# EAGLE design LMNC VCO - v1.2 (EAGLE 9.5.2)

## Sheet 1 of 2
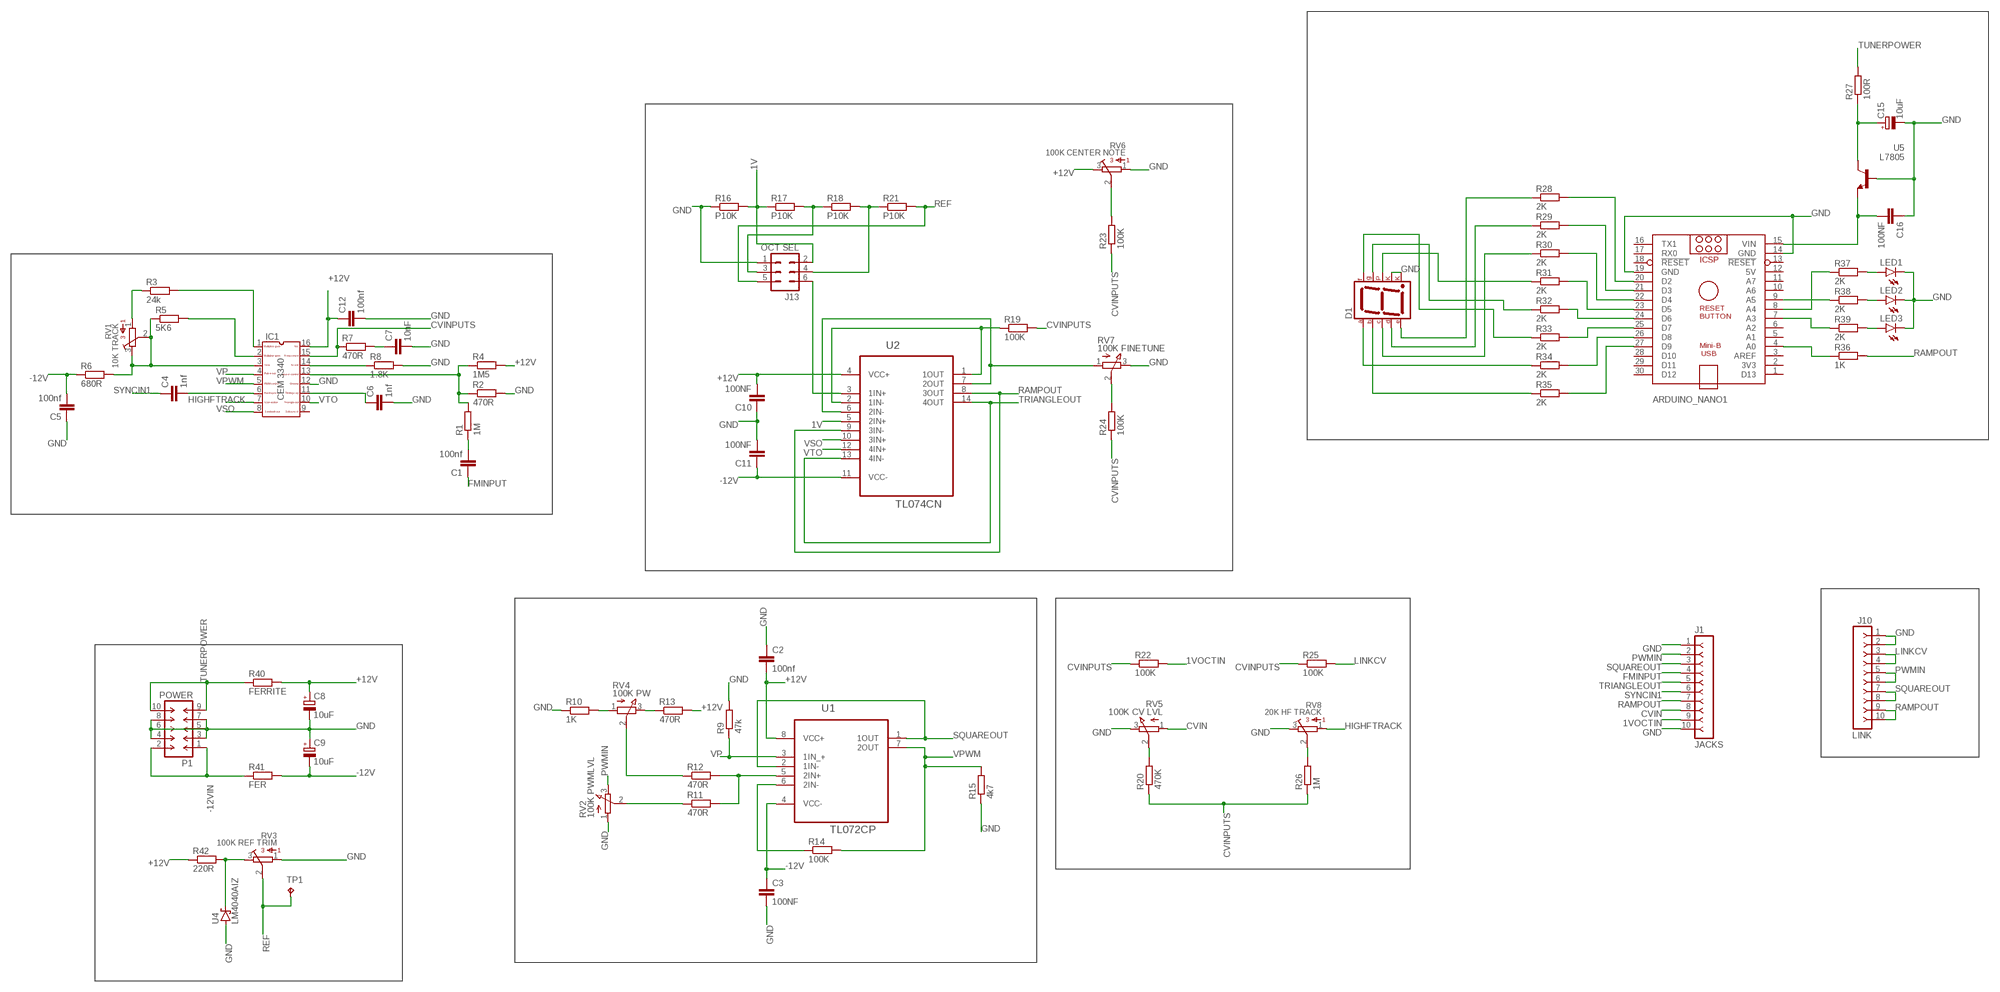
[diagram p0: schematic, sheet 1]

### Parts
ARDUINO_NANO1  ARDUINO_NANO  [ARDUINO_NANO]
C1  100nf  C2,5-3  [C2.5-3]
C2  100nf  C2,5-3  [C2.5-3]
C3  100NF  C2,5-3  [C2.5-3]
C4  1nf  C2,5-3  [C2.5-3]
C5  100nf  C2,5-3  [C2.5-3]
C6  1nf  C2,5-3  [C2.5-3]
C7  10nF  C2,5-3  [C2.5-3]
C8  10uF  CPOL-EUE2.5-5  [E2,5-5]
C9  10uF  CPOL-EUE2.5-5  [E2,5-5]
C10  100NF  C2,5-3  [C2.5-3]
C11  100NF  C2,5-3  [C2.5-3]
C12  100nf  C2,5-3  [C2.5-3]
C15  10uF  CPOL-EUE2.5-5  [E2,5-5]
C16  100NF  C2,5-3  [C2.5-3]
D1  7SEG-CK  [7SEG-13]
IC1  CEM3340  [DIL16]
J1  JACKS  F-1X10-SIP-100-32Y  [SIP-100-10-32Y]
J10  LINK  F-1X10-SIP-100-32Y  [SIP-100-10-32Y]
J13  OCT SEL  MA03-2  [MA03-2]
LED1  LED3MM  [LED3MM]
LED2  LED3MM  [LED3MM]
LED3  LED3MM  [LED3MM]
P1  POWER  M-2X05-DIL-100  [DIL-100-2X05]
R1  1M  R-EU_0207/10  [0207/10]
R2  470R  R-EU_0207/10  [0207/10]
R3  24k  R-EU_0207/10  [0207/10]
R4  1M5  R-EU_0207/10  [0207/10]
R5  5K6  R-EU_0207/10  [0207/10]
R6  680R  R-EU_0207/10  [0207/10]
R7  470R  R-EU_0207/10  [0207/10]
R8  1.8K  R-EU_0207/10  [0207/10]
R9  47k  R-EU_0207/10  [0207/10]
R10  1K  R-EU_0207/10  [0207/10]
R11  470R  R-EU_0207/10  [0207/10]
R12  470R  R-EU_0207/10  [0207/10]
R13  470R  R-EU_0207/10  [0207/10]
R14  100K  R-EU_0207/10  [0207/10]
R15  4k7  R-EU_0207/10  [0207/10]
R16  P10K  R-EU_0207/10  [0207/10]
R17  P10K  R-EU_0207/10  [0207/10]
R18  P10K  R-EU_0207/10  [0207/10]
R19  100K  R-EU_0207/10  [0207/10]
R20  470K  R-EU_0207/10  [0207/10]
R21  P10K  R-EU_0207/10  [0207/10]
R22  100K  R-EU_0207/10  [0207/10]
R23  100K  R-EU_0207/10  [0207/10]
R24  100K  R-EU_0207/10  [0207/10]
R25  100K  R-EU_0207/10  [0207/10]
R26  1M  R-EU_0207/10  [0207/10]
R27  100R  R-EU_0207/10  [0207/10]
R28  2K  R-EU_0207/10  [0207/10]
R29  2K  R-EU_0207/10  [0207/10]
R30  2K  R-EU_0207/10  [0207/10]
R31  2K  R-EU_0207/10  [0207/10]
R32  2K  R-EU_0207/10  [0207/10]
R33  2K  R-EU_0207/10  [0207/10]
R34  2K  R-EU_0207/10  [0207/10]
R35  2K  R-EU_0207/10  [0207/10]
R36  1K  R-EU_0207/10  [0207/10]
R37  2K  R-EU_0207/10  [0207/10]
R38  2K  R-EU_0207/10  [0207/10]
R39  2K  R-EU_0207/10  [0207/10]
R40  FERRITE  R-EU_0207/10  [0207/10]
R41  FER  R-EU_0207/10  [0207/10]
R42  220R  R-EU_0207/10  [0207/10]
RV1  10K TRACK  3386-W  [3386W]
RV2  100K PWMLVL  EVUF2A  [EVUF]
RV3  100K REF TRIM  3386-W  [3386W]
RV4  100K PW  EVUF2A  [EVUF]
RV5  100K CV LVL  EVUF2A  [EVUF]
RV6  100K CENTER NOTE  3386-W  [3386W]
RV7  100K FINETUNE  EVUF2A  [EVUF]
RV8  20K HF TRACK  3386-W  [3386W]
TP1  4v  TPB2,54  [B2,54]
U1  TL072CP  [DIP254P762X508-8]
U2  TL074CN  [DIP254P762X508-14]
U4  LM4040AIZ  SCHOTTKY-DIODE  [SOT54A]
U5  L7805  2SC1306  [TO220BV]

### Nets
1V: J13.2 R16.2 R17.1 U2.5(2IN+)
1VOCTIN: J1.9 R22.2
+12V: C2.2 C8.+ C10.2 C12.1 IC1.16 R4.2 R13.2 R40.2 R42.1 RV6.3 U1.8(VCC+) U2.4(VCC+)
-12V: C3.1 C5.2 C9.- C11.1 R6.1 R41.2 U1.4(VCC-) U2.11(VCC-)
-12VIN: P1.1 P1.2 R41.1
CVIN: J1.8 RV5.1(A)
CVINPUTS: IC1.15 R7.1 R19.2 R20.1 R22.1 R23.1 R24.1 R25.1 R26.1
FMINPUT: C1.1 J1.4
GND: ARDUINO_NANO1.14(GND) ARDUINO_NANO1.19(GND) C2.1 C3.2 C5.1 C6.2 C7.2 C8.- C9.+ C10.1 C11.2 C12.2 C15.- C16.1 D1.3(CK1) D1.8(CK2) IC1.12 J1.1 J1.10 J10.1 J10.2 J13.1 LED1.K(C) LED2.K(C) LED3.K(C) P1.3 P1.4 P1.5 P1.6 P1.7 P1.8 R2.2 R8.2 R9.2 R10.1 R15.1 R16.1 RV2.1(A) RV3.1 RV5.3(E) RV6.1 RV7.3(E) RV8.3 U4.A1(A) U5.1(B)
HIGHFTRACK: IC1.7 RV8.1
LINKCV: J10.3 J10.4 R25.2
N$1: IC1.2 R5.2
N$2: IC1.1 R3.2
N$3: IC1.3 R5.1 R6.2 RV1.2 RV1.3
N$4: R3.1 RV1.1
N$5: C7.1 R7.2
N$6: C1.2 R1.1
N$7: C4.2 IC1.6
N$8: C6.1 IC1.11
N$9: R14.1 U1.6(2IN-)
N$10: R11.2 R12.2 U1.5(2IN+)
N$11: IC1.14 R8.1
N$12: IC1.13 R1.2 R2.1 R4.1
N$13: R12.1 RV4.2(S)
N$14: R11.1 RV2.2(S)
N$15: R10.2 RV4.1(A)
N$16: R13.1 RV4.3(E)
N$17: RV7.1(A) U2.6(2IN-) U2.7(2OUT)
N$18: J13.6 U2.3(1IN+)
N$19: C15.+ R27.1 U5.2(C)
N$20: J13.3 R17.2 R18.1
N$21: J13.4 R18.2 R21.1
N$22: R24.2 RV7.2(S)
N$23: R19.1 U2.1(1OUT) U2.2(1IN-)
N$24: R23.2 RV6.2
N$25: ARDUINO_NANO1.24(D6) R32.2
N$29: R20.2 RV5.2(S)
N$30: R26.2 RV8.2
N$31: R42.2 RV3.3 U4.A2(C)
N$32: ARDUINO_NANO1.25(D7) R33.2
N$33: ARDUINO_NANO1.26(D8) R34.2
N$34: ARDUINO_NANO1.27(D9) R35.2
N$35: ARDUINO_NANO1.23(D5) R31.2
N$36: ARDUINO_NANO1.22(D4) R30.2
N$37: ARDUINO_NANO1.21(D3) R29.2
N$38: ARDUINO_NANO1.20(D2) R28.2
N$39: ARDUINO_NANO1.9(A5) R38.1
N$40: ARDUINO_NANO1.7(A3) R39.1
N$41: ARDUINO_NANO1.8(A4) R37.1
N$42: LED1.A R37.2
N$43: LED2.A R38.2
N$44: LED3.A R39.2
N$45: ARDUINO_NANO1.4(A0) R36.1
N$46: ARDUINO_NANO1.15(VIN) C16.2 U5.3(E)
N$47: D1.6(B) R35.1
N$48: D1.7(A) R34.1
N$49: D1.4(C) R30.1
N$50: D1.2(D) R29.1
N$51: D1.1(E) R28.1
N$52: D1.9(F) R33.1
N$53: D1.10(G) R32.1
N$54: D1.5(DP) R31.1
PWMIN: J1.2 J10.5 J10.6 RV2.3(E)
RAMPOUT: J1.7 J10.9 J10.10 R36.2 U2.8(3OUT) U2.9(3IN-)
REF: J13.5 R21.2 RV3.2 TP1.TP
SQUAREOUT: J1.3 J10.7 J10.8 U1.1(1OUT) U1.2(1IN-)
SYNCIN1: C4.1 J1.6
TRIANGLEOUT: J1.5 U2.13(4IN-) U2.14(4OUT)
TUNERPOWER: P1.9 P1.10 R27.2 R40.1
VP: IC1.4 R9.1 U1.3(1IN_+)
VPWM: IC1.5 R14.2 R15.2 U1.7(2OUT)
VSO: IC1.8 U2.10(3IN+)
VTO: IC1.10 U2.12(4IN+)
Unconnected: ARDUINO_NANO1.1(D13) ARDUINO_NANO1.2(3V3) ARDUINO_NANO1.3(AREF) ARDUINO_NANO1.5(A1) ARDUINO_NANO1.6(A2) ARDUINO_NANO1.10(A6) ARDUINO_NANO1.11(A7) ARDUINO_NANO1.13(!RESET) ARDUINO_NANO1.16(TX1) ARDUINO_NANO1.17(RX0) ARDUINO_NANO1.18(!RESET) ARDUINO_NANO1.28(D10) ARDUINO_NANO1.29(D11) ARDUINO_NANO1.30(D12) IC1.9

## Sheet 2 of 2

## Power pins joined to a net without a drawn wire
5V: ARDUINO_NANO1.12(5V)

## Library data of the parts
ARDUINO_NANO1 = ArduinoNanoV30:ARDUINO_NANO: Arduino Nano V3.0 Overview: The Arduino Nano is a small, complete, and breadboard-friendly board based on the ATmega328 (Arduino Nano 3.x) or ATmega168 (Arduino Nano 2.x). It has more or less the same functionality of the Arduino Duemilanove, but in a different package. It lacks only a DC power jack, and works with a Mini-B USB cable instead of a standard one. The Nano was designed and is being produced by Gravitech. Specifications: Microcontroller Atmel ATmega168 or ATmega328 Operating Voltage (logic level) 5 V Input Voltage (recommended) 7-12 V Input Voltage (limits) 6-20 V Digital I/O Pins 14 (of which 6 provide PWM output) Analog Input Pins 8 DC Current per I/O Pin 40 mA Flash Memory 16 KB (ATmega168) or 32 KB (ATmega328) of which 2 KB used by bootloader SRAM 1 KB (ATmega168) or 2 KB (ATmega328) EEPROM 512 bytes (ATmega168) or 1 KB (ATmega328) Clock Speed 16 MHz Dimensions 0.73" x 1.70" Length 45 mm Width 18 mm Weigth 5 g Power: The Arduino Nano can be powered via the Mini-B USB connection, 6-20V unregulated external power supply (pin 30), or 5V regulated external power supply (pin 27). The power source is automatically selected to the highest voltage source. Memory: The ATmega168 has 16 KB of flash memory for storing code (of which 2 KB is used for the bootloader); the ATmega328 has 32 KB, (also with 2 KB used for the bootloader). The ATmega168 has 1 KB of SRAM and 512 bytes of EEPROM (which can be read and written with the EEPROM library); the ATmega328 has 2 KB of SRAM and 1 KB of EEPROM. Input and Output: Each of the 14 digital pins on the Nano can be used as an input or output, using pinMode(), digitalWrite(), and digitalRead() functions. They operate at 5 volts. Each pin can provide or receive a maximum of 40 mA and has an internal pull-up resistor (disconnected by default) of 20-50 kOhms. In addition, some pins have specialized functions. Visit Arduino - ArduinoBoardNano <https://www.arduino.cc/en/Main/ArduinoBoardNano>
C1-C7 C10-C12 C16 = capacitor-wima:C: CAPACITOR naming: grid - package width
C8 C9 C15 = rcl:CPOL-EU: POLARIZED CAPACITOR, European symbol; SPICEPREFIX: C
D1 = special:7SEG-CK: 7-segment DISPLAY single cathode, 13 mm
IC1 = CEM:CEM3340: CEM 3340 VCO
J1 = con-headers-jp:F-1X10-: FEMALE HEADER; SPICEPREFIX: X
J10 = con-headers-jp:F-1X10-: FEMALE HEADER
J13 = con-lstb:MA03-2: PIN HEADER; OC_FARNELL: unknown; OC_NEWARK: unknown
LED1-LED3 = led:LED: LED OSRAM: - CHIPLED LG R971, LG N971, LY N971, LG Q971, LY Q971, LO R971, LY R971 LH N974, LH R974 LS Q976, LO Q976, LY Q976 LO Q996 - Hyper CHIPLED LW Q18S LB Q993, LB Q99A, LB R99A - SideLED LS A670, LO A670, LY A670, LG A670, LP A670 LB A673, LV A673, LT A673, LW A673 LH A674 LY A675 LS A676, LA A676, LO A676, LY A676, LW A676 LS A679, LY A679, LG A679 - Hyper Micro SIDELED® LS Y876, LA Y876, LO Y876, LY Y876 LT Y87S - SmartLED LW L88C, LW L88S LB L89C, LB L89S, LG L890 LS L89K, LO L89K, LY L89K LS L896, LA L896, LO L896, LY L896 - TOPLED LS T670, LO T670, LY T670, LG T670, LP T670 LSG T670, LSP T670, LSY T670, LOP T670, LYG T670 LG T671, LOG T671, LSG T671 LB T673, LV T673, LT T673, LW T673 LH T674 LS T676, LA T676, LO T676, LY T676, LB T676, LH T676, LSB T676, LW T676 LB T67C, LV T67C, LT T67C, LS T67K, LO T67K, LY T67K, LW E67C LS E67B, LA E67B, LO E67B, LY E67B, LB E67C, LV E67C, LT E67C LW T67C LS T679, LY T679, LG T679 LS T770, LO T770, LY T770, LG T770, LP T770 LB T773, LV T773, LT T773, LW T773 LH T774 LS E675, LA E675, LY E675, LS T675 LS T776, LA T776, LO T776, LY T776, LB T776 LHGB T686 LT T68C, LB T68C - Hyper Mini TOPLED® LB M676 - Mini TOPLED Santana® LG M470 LS M47K, LO M47K, LY M47K Source: http://www.osram.convergy.de LUXEON: - LUMILED® LXK2-PW12-R00, LXK2-PW12-S00, LXK2-PW14-U00, LXK2-PW14-V00 LXK2-PM12-R00, LXK2-PM12-S00, LXK2-PM14-U00 LXK2-PE12-Q00, LXK2-PE12-R00, LXK2-PE12-S00, LXK2-PE14-T00, LXK2-PE14-U00 LXK2-PB12-K00, LXK2-PB12-L00, LXK2-PB12-M00, LXK2-PB14-N00, LXK2-PB14-P00, LXK2-PB14-Q00 LXK2-PR12-L00, LXK2-PR12-M00, LXK2-PR14-Q00, LXK2-PR14-R00 LXK2-PD12-Q00, LXK2-PD12-R00, LXK2-PD12-S00 LXK2-PH12-R00, LXK2-PH12-S00 LXK2-PL12-P00, LXK2-PL12-Q00, LXK2-PL12-R00 Source: www.luxeon.com KINGBRIGHT: KA-3528ASYC Source: www.kingbright.com
P1 = con-headers-jp:M-2X05-: MALE HEADER
R1-R42 = rcl:R-EU_: RESISTOR, European symbol; SPICEPREFIX: R
RV1 RV3 RV6 RV8 = bourns:3386-: 3386 Series 3/8" Square Trimmer
RV2 RV4 RV5 RV7 = pot:EVU: 9 mm Square Rotary Potentiometers Source: Panasonic
TP1 = testpad:TP: Test pad
U1 = TL072CP:TL072CP: OPERATIONAL AMPLIFIER; AVAILABILITY: Unavailable; DESCRIPTION: J-FET Amplifier 2 Circuit 8-PDIP; MF: Texas Instruments; MP: TL072CP; PACKAGE: PDIP-8 ON Semiconductor; PRICE: None
U2 = TL074CN:TL074CN: LOW-NOISE JFET-INPUT OPERATIONAL AMPLIFIERS; AVAILABILITY: Unavailable; DESCRIPTION: J-FET Amplifier 4 Circuit 14-DIP; MF: STMicroelectronics; MP: TL074CN; PACKAGE: DIP-14 STMicroelectronics; PRICE: None
U4 = diode-costum:SCHOTTKY-DIODE: Schottky Diode
U5 = transistor:2SC1306: NPN Transistor Final RF Power Outupt Source: 2sc1306.pdf

## Board
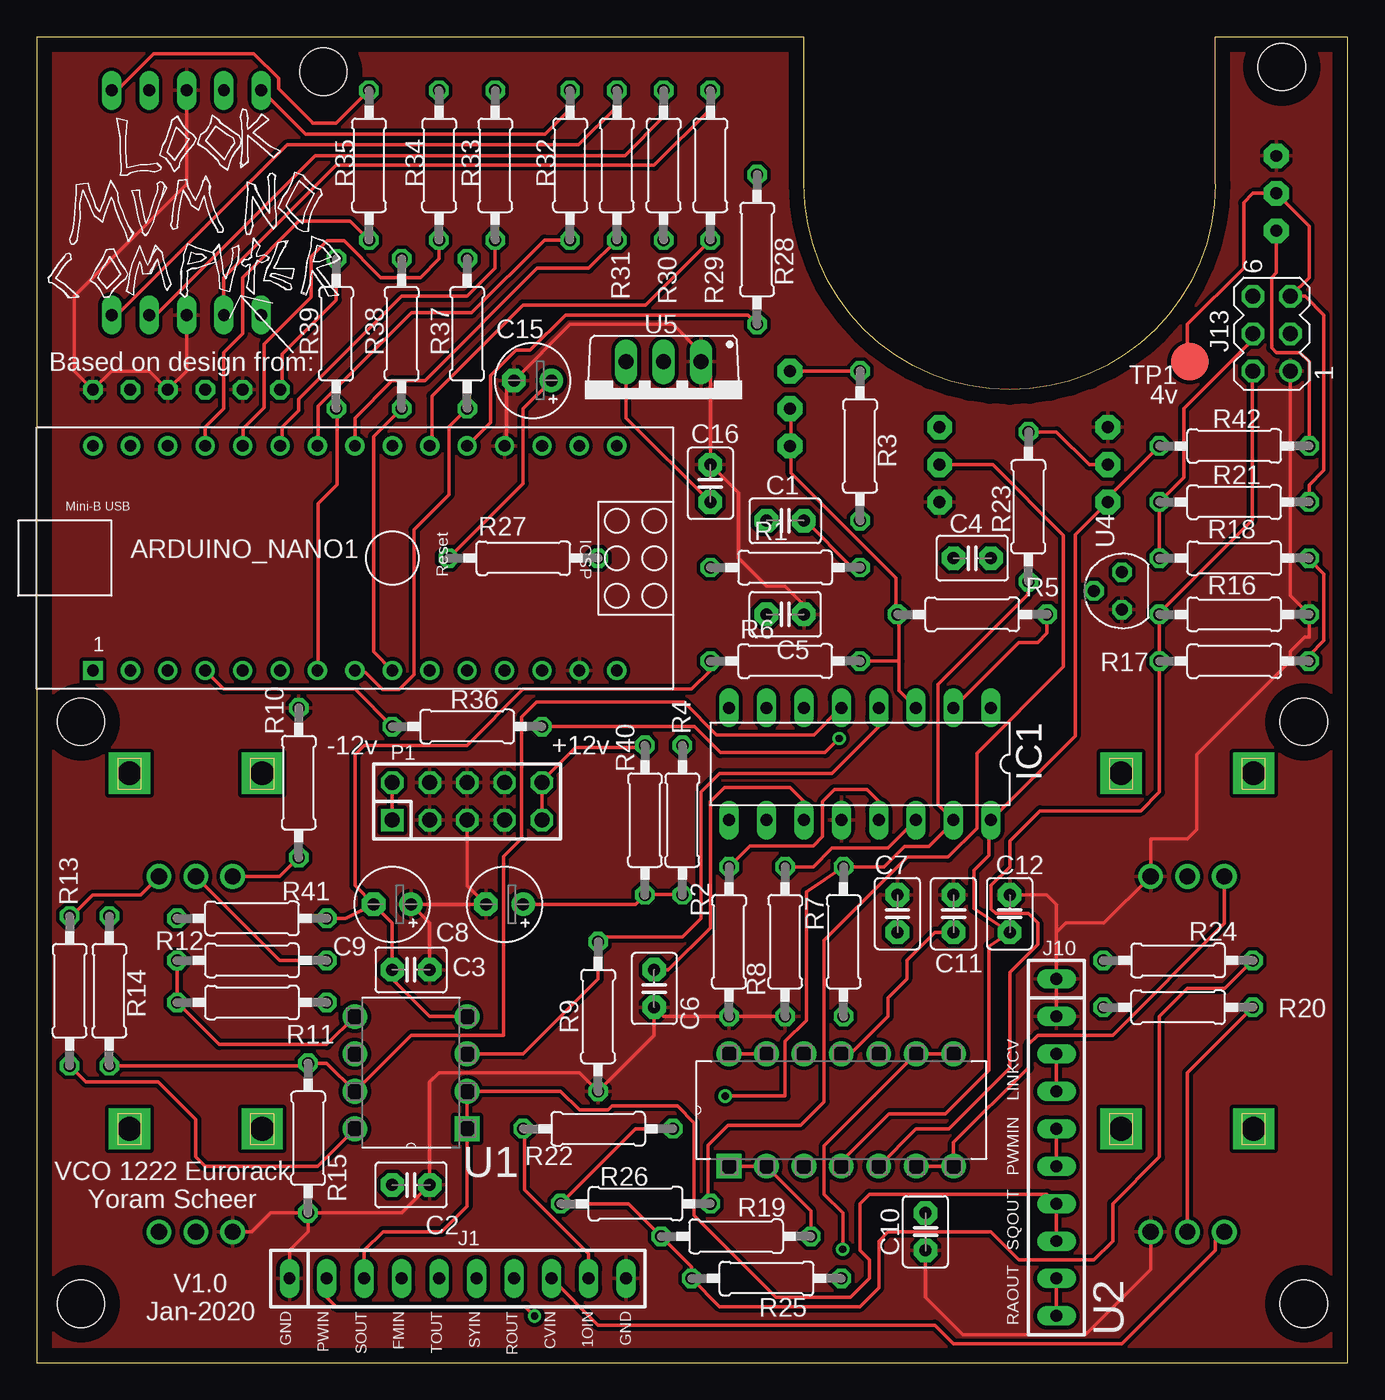
[diagram p1: board, top side]
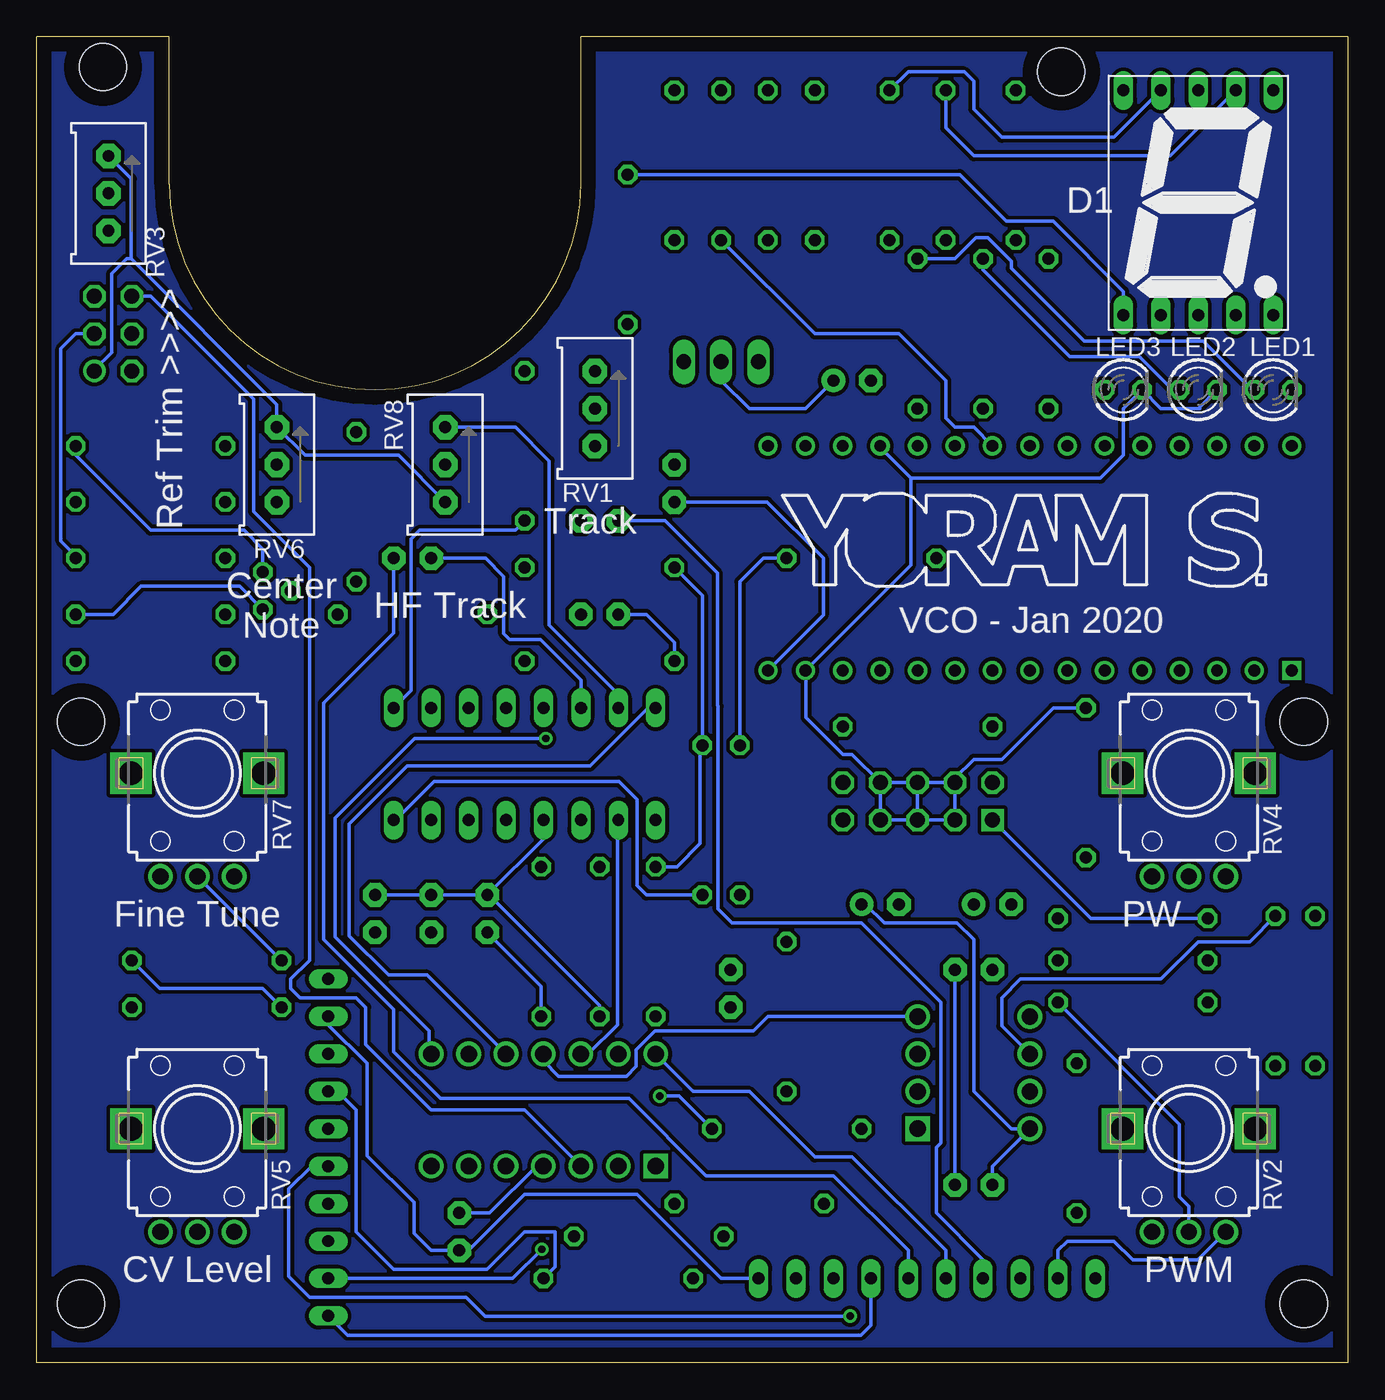
[diagram p2: board, bottom side, seen from below]

Size 89 x 90 mm. Coordinates in mm from the lower left corner, seen from the top.
Outline: 0,0 89,0 89,90 80.01,90 80.01,80.01 arc-180 52.07,80.01 52.07,90 0,90 0,0
Copper layers (1*16): Top 0.035mm / dielectric 1.5mm / Bottom 0.035mm
Design rules "default *": minimum track width 10mil, minimum drill 0.35mm, track to track 8mil, track to pad 6mil, pad to pad 6mil, via to via 6mil, smd to smd 6mil, copper to edge 40mil, drill to drill 6mil, minimum pad ring 10mil, minimum via ring 8mil, stop-mask expansion 4mil, vias tented up to drill 0mil, thermal gap 10mil
Holes 3.2 mm at 3,4 86,4 19.46,87.63 84.51,87.95 3,43.5 86,43.5

### Footprints (pad centres in the part's own frame; a part is rotated, then mirrored left to right if it is on the bottom)
ARDUINO_NANO = drill 0.8 square: 1 -20.32,-7.62 | drill 0.8: 2 -17.78,-7.62; 3 -15.24,-7.62; 4 -12.7,-7.62; 5 -10.16,-7.62; 6 -7.62,-7.62; 7 -5.08,-7.62; 8 -2.54,-7.62; 9 0,-7.62; 10 2.54,-7.62; 11 5.08,-7.62; 12 7.62,-7.62; 13 10.16,-7.62; 14 12.7,-7.62; 15 15.24,-7.62; 16 15.24,7.62; 17 12.7,7.62; 18 10.16,7.62; 19 7.62,7.62; 20 5.08,7.62; 21 2.54,7.62; 22 0,7.62; 23 -2.54,7.62; 24 -5.08,7.62; 25 -7.62,7.62; 26 -10.16,7.62; 27 -12.7,7.62; 28 -15.24,7.62; 29 -17.78,7.62; 30 -20.32,7.62
C2.5-3 = drill 0.813 pad 1.6 octagon: 1 -1.27,0; 2 1.27,0
E2,5-5 = drill 0.813 pad 1.6: + -1.27,0 | drill 0.813 pad 1.6 octagon: - 1.27,0
7SEG-13 = drill 0.813 long: 1 -5.08,-7.62; 2 -2.54,-7.62; 3 0,-7.62; 4 2.54,-7.62; 5 5.08,-7.62; 6 5.08,7.62; 7 2.54,7.62; 8 0,7.62; 9 -2.54,7.62; 10 -5.08,7.62
DIL16 = drill 0.813 long: 1 -8.89,-3.81; 2 -6.35,-3.81; 3 -3.81,-3.81; 4 -1.27,-3.81; 5 1.27,-3.81; 6 3.81,-3.81; 7 6.35,-3.81; 8 8.89,-3.81; 9 8.89,3.81; 10 6.35,3.81; 11 3.81,3.81; 12 1.27,3.81; 13 -1.27,3.81; 14 -3.81,3.81; 15 -6.35,3.81; 16 -8.89,3.81
SIP-100-10-32Y = drill 0.813 long: 1 -11.43,0; 2 -8.89,0; 3 -6.35,0; 4 -3.81,0; 5 -1.27,0; 6 1.27,0; 7 3.81,0; 8 6.35,0; 9 8.89,0; 10 11.43,0
MA03-2 = drill 1.016: 1 -2.54,-1.27 | drill 1.016 octagon: 2 -2.54,1.27; 3 0,-1.27; 4 0,1.27; 5 2.54,-1.27; 6 2.54,1.27
LED3MM = drill 0.813 octagon: A -1.27,0; K 1.27,0
DIL-100-2X05 = drill 1.016 square: 1 -5.08,-1.27 | drill 1.016 octagon: 2 -5.08,1.27; 3 -2.54,-1.27; 4 -2.54,1.27; 5 0,-1.27; 6 0,1.27; 7 2.54,-1.27; 8 2.54,1.27; 9 5.08,-1.27; 10 5.08,1.27
0207/10 = drill 0.813 octagon: 1 -5.08,0; 2 5.08,0
3386W = drill 0.813 pad 1.676 octagon: 1 2.54,0.318; 2 0,0.318; 3 -2.54,0.318
EVUF = drill 1.1 pad 1.676: 1 -2.5,-7; 2 0,-7; 3 2.5,-7 | drill 1.6 pad 2.8 square: M1 4.5,0; M2 -4.5,0
B2,54 = smd 2.54 x 2.54: TP 0,0
DIP254P762X508-8 = drill 1.118 square: 1 -7.62,7.62 | drill 1.118: 2 -7.62,5.08; 3 -7.62,2.54; 4 -7.62,0; 5 0,0; 6 0,2.54; 7 0,5.08; 8 0,7.62
DIP254P762X508-14 = drill 1.118 square: 1 -7.62,15.24 | drill 1.118: 2 -7.62,12.7; 3 -7.62,10.16; 4 -7.62,7.62; 5 -7.62,5.08; 6 -7.62,2.54; 7 -7.62,0; 8 0,0; 9 0,2.54; 10 0,5.08; 11 0,7.62; 12 0,10.16; 13 0,12.7; 14 0,15.24
SOT54A = drill 0.813 octagon: A1 -1.27,0; A2 1.27,0; C 0,1.905
TO220BV = drill 1.016 long: 1 -2.54,-2.54; 2 0,-2.54; 3 2.54,-2.54

### Placement (x,y rotation side)
ARDUINO_NANO1  24.13,54.61 0 top
C1  50.8,57.15 0 top
C2  25.4,12.06 180 top
C3  25.4,26.67 0 top
C4  63.5,54.61 180 top
C5  50.8,50.8 180 top
C6  41.91,25.4 270 top
C7  58.42,30.48 90 top
C8  31.75,31.11 180 top
C9  24.13,31.11 180 top
C10  60.33,8.89 90 top
C11  62.23,30.48 90 top
C12  66.04,30.48 90 top
C15  33.66,66.67 180 top
C16  45.72,59.69 270 top
D1  10.16,78.74 0 bottom
IC1  55.88,40.64 180 top
J1  28.57,5.71 0 top
J10  69.22,14.61 270 top
J13  83.82,69.85 90 top
LED1  5.08,66.04 0 bottom
LED2  10.16,66.04 0 bottom
LED3  15.24,66.04 0 bottom
P1  29.21,38.1 0 top
R1  50.8,53.98 180 top
R2  46.99,28.57 270 top
R3  55.88,62.23 270 top
R4  43.81,36.83 270 top
R5  63.5,50.8 0 top
R6  50.8,47.62 0 top
R7  54.77,28.57 270 top
R8  50.8,28.57 270 top
R9  38.1,23.5 270 top
R10  17.78,39.37 270 top
R11  14.61,24.45 180 top
R12  14.61,27.3 180 top
R13  2.22,25.24 270 top
R14  4.92,25.24 270 top
R15  18.41,15.24 90 top
R16  81.28,50.8 180 top
R17  81.28,47.62 0 top
R18  81.28,54.61 180 top
R19  47.47,8.57 180 top
R20  77.47,24.13 0 top
R21  81.28,58.42 0 top
R22  38.1,15.88 180 top
R23  67.31,58.1 90 top
R24  77.47,27.3 180 top
R25  49.53,5.71 0 top
R26  40.64,10.79 0 top
R27  33.02,54.61 0 top
R28  48.9,75.56 270 top
R29  45.72,81.28 270 top
R30  42.55,81.28 270 top
R31  39.37,81.28 270 top
R32  36.2,81.28 270 top
R33  31.11,81.28 270 top
R34  27.3,81.28 270 top
R35  22.54,81.28 270 top
R36  29.21,43.18 0 top
R37  29.21,69.85 90 top
R38  24.77,69.85 90 top
R39  20.32,69.85 90 top
R40  41.27,36.83 270 top
R41  14.61,30.16 0 top
R42  81.28,62.23 0 top
RV1  50.8,64.77 90 bottom
RV2  10.79,15.88 0 bottom
RV3  83.82,79.38 90 bottom
RV4  10.79,40.01 0 bottom
RV5  78.11,15.88 0 bottom
RV6  72.39,60.96 90 bottom
RV7  78.11,40.01 0 bottom
RV8  60.96,60.96 90 bottom
TP1  78.26,67.94 0 top
U1  21.59,23.5 180 top
U2  62.23,20.95 90 top
U4  73.66,52.39 90 top
U5  42.55,65.41 180 top

### Tracks (layer width: path | path; a pad name or v marks a point on that pad's centre or on a via)
1V
  Top 0.254: J13.2 82.5,67.16 82.5,57.2 76.2,50.9 R16.2 R17.1 76.2,38.73 74.93,37.47 68.1,37.47 66.04,35.41 66.04,33.66 64.77,32.38 64.77,30.8 65.09,30.48 67.31,30.48 67.94,29.84 67.94,28.4 66.04,26.49 66.04,20 61.91,15.88 59.69,15.88 U2.5
1VOCTIN
  Top 0.254: J1.9 37.47,7.4 33.12,11.74 33.12,15.72 R22.2
+12V
  Top 0.254: R4.2 43.76,31.8 41.38,31.8 R40.2 40.64,31.11 C8.+ | U2.4 54.61,13.66 57.85,16.9 61.68,16.9 64.62,19.84 64.62,28.26 C12.1 63.6,30.84 63.6,33.43 64.62,34.44 64.62,36.68 IC1.16 70.48,42.55 70.48,56.2 RV6.3 72.71,58.74 R42.1 | R13.2 3.33,19.05 8.26,19.05 10.79,16.51 10.79,13.97 11.43,13.34 19.05,13.34 U1.8
  Bottom 0.254: C8.+ 32.74,31.11 31.47,29.84 26.53,29.84 25.4,28.71 25.4,18.41 22.86,15.88 U1.8 24.13,13.34 C2.2 | C10.2 58.26,10.16 55.09,13.34 U2.4 | IC1.16 64.62,36.88 62.04,39.46 49.49,39.46 48.25,38.21 48.26,38.2 48.26,32.38 47.62,31.75 R4.2
-12V
  Top 0.254: C11.1 60.96,29.21 59.05,27.3 59.05,26.04 57.78,24.77 57.78,23.5 55.24,20.95 U2.11 | C9.- 20.95,30.16 R41.2 | U1.4 26.67,23.5 24.13,26.04 C3.1 24.13,29.84 C9.- | C9.- 21.59,32.38 21.59,41.27 22.23,41.91 29.21,41.91 33.02,45.72 44.45,45.72 45.72,46.99 R6.1
  Bottom 0.254: U2.11 54.61,20.47 53.58,19.44 48.97,19.44 48.32,20.1 48.32,21.23 47.03,22.52 40.35,22.52 39.37,23.5 U1.4 | R6.1 45.72,48.9 47.62,50.8 C5.2
-12VIN
  Top 0.254: P1.2 P1.1
  Bottom 0.254: R41.1 17.46,30.16 P1.1
CVIN
  Top 0.254: J1.8 38.1,2.54 60.96,2.54 62.23,1.27 73.66,1.27 80.01,7.62 80.01,8.28 RV5.1
CVINPUTS  (via drill 0.5)
  Top 0.254: R23.1 67.26,52.87 67.26,52.15 61.16,46.05 61.16,37.9 IC1.15 62.18,36.68 60.55,35.05 58.9,35.05 57.51,33.66 R7.1 52.23,31.97 52.23,23.23 50.8,21.79 50.8,18.1 v46.72,18.1 | R24.1 80.64,25.4 78.11,25.4 76.2,23.5 76.2,13.97 73.03,10.79 73.03,8.26 71.75,6.99 66.67,6.99 64.77,8.89 57.78,8.89 57.15,8.26 57.15,5.08 55.88,3.81 46.35,3.81 R25.1 44.45,6.51 R19.2 40.16,10.79 R26.1 40.64,15.88 R22.1
  Bottom 0.254: v46.72,18.1 45.4,18.1 R22.1 | R20.1 73.66,25.4 80.64,25.4 R24.1
FMINPUT
  Bottom 0.254: J1.4 24.77,6.99 27.94,10.16 27.94,14.61 27.62,14.92 27.62,24.45 33.02,29.84 41.8,29.84 42.75,30.8 42.75,44.56 42.8,44.62 42.8,53.59 46.35,57.15 C1.1
GND
  Top 0.254: D1.3 10.16,67.31 LED2.K 7.62,67.31 5.08,67.31 LED1.K 2.54,67.31 2.54,72.39 10.16,80.01 D1.8 | ARDUINO_NANO1.19 31.9,62.28 31.9,66.19 C15.- 36.2,70.48 43.18,70.48 45.09,68.58 U5.1 45.72,67.31 C16.1 47.62,59.05 47.62,54.61 49.53,52.7 50.8,52.7 52.07,51.44 C5.1 | RV5.3 75.61,6.33 71.16,1.89 62.88,1.89 60.33,4.45 C10.1 | C3.2 26.67,29.84 C9.+ C8.- 29.21,32.38 P1.5 | R8.2 R2.2 42.55,23.5 C6.2 41.91,22.23 R9.2 36.83,19.68 27.3,19.68 26.67,19.05 C2.1 24.77,10.16 R15.1 | J10.1 69.22,29.21 69.85,29.84 72.44,29.84 RV7.3 75.61,35.56 78.11,35.56 78.74,36.2 78.74,41.27 85.09,47.62 85.09,48.26 86.08,49.25 86.36,49.25 R16.1 85.09,52.07 J13.1 | J10.2 J10.1 | R15.1 15.88,10.16 14.59,8.88 RV2.1 | J1.1 17.14,7.62 18.41,8.89 R15.1 | C12.2 68.58,31.75 69.22,31.11 J10.1
  Bottom 0.254: 29.67,60.05 31.7,62.08 ARDUINO_NANO1.19 | R8.2 50.8,24.26 58.29,31.75 C7.2 | 29.67,60.05 29.67,54.15 ARDUINO_NANO1.14 36.78,46.84 36.78,43.79 34.27,41.27 33.66,41.27 P1.8 | 82.59,74.93 82.59,80.37 RV3.1 | 82.59,74.93 82.91,74.93 83.92,73.91 83.92,68.58 85.09,67.41 J13.1 | C7.2 54.61,35.56 IC1.12 | C7.2 C11.2 C12.2 | C3.2 C2.1 | J10.2 69.22,22.94 66.57,20.3 66.57,14.05 63.4,10.87 63.4,8.79 62.23,7.62 C10.1 59.69,7.62 55.88,11.43 48.26,11.43 42.55,5.71 J1.10 | P1.4 P1.6 | P1.6 P1.8 | P1.5 P1.3 P1.4 | P1.5 P1.7 P1.8 | P1.5 P1.6 | LED2.K 10.07,64.86 10.07,64.76 12.69,64.76 LED3.K 15.24,64.77 15.24,61.59 16.79,60.05 29.67,60.05 | R10.1 20,44.45 23.5,40.96 25.4,40.96 26.67,39.69 P1.4 | 82.59,74.93 72.71,65.05 RV6.1 70.8,61.59 64.45,61.59 RV8.3 | U4.A1 75.25,52.7 81.92,52.7 83.82,50.8 R16.1
  pour Top (isolate 0.254): 80.01,90 80.01,79.69 arc-90 66.36,66.04 arc-90 52.07,80.33 52.07,90 0,90 0,0 89,0 89,90
GND1
  pour Bottom (isolate 0.254): 80.01,90 80.01,79.69 arc-90 66.36,66.04 arc-90 52.07,80.33 52.07,90 0,90 0,0 89,0 89,90
HIGHFTRACK
  Bottom 0.254: IC1.7 49.58,44.6 49.58,45.41 54.23,50.06 54.23,61.21 56.52,63.5 RV8.1
LINKCV
  Top 0.254: J10.3 J10.4
  Bottom 0.254: R25.2 53.82,6.51 53.82,8.89 55.88,8.89 58.42,6.35 64.77,6.35 67.31,8.89 67.31,17.14 68.58,18.41 J10.4
N$1
  Top 0.254: IC1.2 66.67,48.9 67.94,48.9 68.58,49.53 R5.2
N$2
  Bottom 0.254: R3.2 56.52,56.52 63.01,56.52 63.6,55.92 63.6,45.62 IC1.1
N$3
  Top 0.254: RV1.2 51.21,64.72 51.21,62.28 RV1.3 51.21,62.08 51.21,60.38 58.32,53.26 58.32,50.95 R5.1 58.52,50.75 58.52,47.62 | 58.52,47.62 58.52,45.62 IC1.3 | R6.2 58.52,47.62
N$4
  Top 0.254: RV1.1 R3.1
N$5
  Bottom 0.254: C7.1 54.77,25.56 R7.2
N$6
  Top 0.254: R1.1 55.35,53.98 52.17,57.15 C1.2
N$7
  Bottom 0.254: IC1.6 52.07,46.35 54.81,49.1 56.92,49.1 57.3,49.48 57.3,53.38 58.53,54.61 C4.2
N$8
  Top 0.254: IC1.11 52.07,38.1 51.12,39.05 46.67,39.05 45.72,38.1 45.72,29.53 42.86,26.67 C6.1
N$9
  Bottom 0.254: R14.1 6.67,28.57 10.16,28.57 12.7,26.04 22.23,26.04 23.5,24.77 23.5,22.86 U1.6
N$10
  Top 0.254: R12.2 R11.2 12.38,21.59 19.68,21.59 U1.5
N$11
  Top 0.254: R8.1 52.7,33.66 53.98,34.92 57.78,34.92 IC1.14
N$12
  Top 0.254: R2.1 48.42,35.08 52.7,35.08 53.34,35.72 53.34,38.1 54.13,38.89 56.36,38.89 57.15,38.1 IC1.13
  Bottom 0.254: R1.2 43.81,52.07 R4.1 43.97,41.76 43.97,35.24 45.55,33.66 R2.1
N$13
  Top 0.254: RV4.2 16.5,27.3 R12.1
N$14
  Bottom 0.254: R11.1 11.43,16.19 11.43,11.27 10.79,10.63 RV2.2
N$15
  Top 0.254: R10.2 16.5,33.01 RV4.1
N$16
  Top 0.254: R13.1 2.38,30.32 3.81,31.75 7.04,31.75 RV4.3
N$17
  Top 0.254: U2.6 U2.7 62.23,14.94 67.31,20.02 67.31,21.59 67.94,22.23 73.03,22.23 80.61,29.8 RV7.1
N$18
  Bottom 0.254: U2.3 55.88,17.14 62.23,17.14 66.67,21.59 66.67,24.13 67.31,24.77 71.12,24.77 71.75,25.4 71.75,26.04 70.48,27.3 70.48,53.98 74.3,57.78 74.3,65.41 81.28,72.39 J13.6
N$19
  Top 0.254: R27.1 33.02,59.69 33.02,64.77 C15.+
  Bottom 0.254: C15.+ 36.83,64.77 40.64,64.77 42.55,66.67 U5.2
N$20
  Top 0.254: R18.1 86.36,54.56 87.38,53.54 87.38,49.02 86.36,48.01 R17.2
  Bottom 0.254: J13.3 86.36,69.85 87.38,68.83 87.38,55.78 86.36,54.76 R18.1
N$21
  Top 0.254: R18.2 R21.1 77.85,60.07 77.85,64.77 82.5,69.42 82.5,69.8 J13.4
N$22
  Bottom 0.254: RV7.2 72.41,27.3 R24.2
N$23
  Top 0.254: U2.1 U2.2 52.55,10.32 R19.1
N$24
  Top 0.254: R23.2 69.22,63.18 71.44,60.96 RV6.2
N$25
  Top 0.254: ARDUINO_NANO1.24 19.1,62.28 19.1,64.92 25.45,71.27 29.52,71.27 34.45,76.2 R32.2
N$29
  Top 0.254: R20.2 78.11,19.68 RV5.2
N$30
  Top 0.254: R26.2 45.56,10.82 45.56,14.75 46.92,16.11 51.84,16.11 53.44,17.72 53.44,28.66 59.11,34.33 61.86,34.33 63.8,36.27 63.8,41.35 69.7,47.24 69.7,56.15 64.89,60.96 RV8.2
N$31
  Top 0.254: RV3.3 84.14,73.98 83.82,73.66 83.82,68.9 84.14,68.58 85.72,68.58 86.36,67.94 R42.2
  Bottom 0.254: U4.A2 73.66,55.24 74.93,56.52 81.28,56.52 86.36,61.59 R42.2
N$32
  Top 0.254: ARDUINO_NANO1.25 16.66,62.28 16.66,63.5 17.78,64.62 17.78,65.41 24.77,72.39 29.21,72.39 31.11,74.3 R33.2
N$33
  Top 0.254: ARDUINO_NANO1.26 14.02,62.28 14.02,63.4 15.44,64.82 15.44,69.14 18.62,72.31 18.62,75.08 19.69,76.15 20.85,76.15 23.34,73.66 26.04,73.66 27.3,74.93 R34.2
N$34
  Top 0.254: ARDUINO_NANO1.27 11.43,63.5 12.7,64.77 12.7,68.58 13.97,69.85 13.97,73.66 17.78,77.47 21.27,77.47 R35.2
N$35
  Top 0.254: R31.2 37.47,74.3 33.97,74.3 26.35,66.67 24.13,66.67 21.59,64.14 ARDUINO_NANO1.23
N$36
  Bottom 0.254: ARDUINO_NANO1.22 25.4,63.5 26.67,63.5 27.3,64.14 27.3,66.67 30.48,69.85 36.2,69.85 R30.2
N$37
  Top 0.254: ARDUINO_NANO1.21 26.82,62.28 26.82,65.62 33,71.8 41.32,71.8 R29.2
N$38
  Top 0.254: ARDUINO_NANO1.20 30.8,63.82 30.8,66.99 32.54,68.74 33.5,68.74 35.88,71.12 48.26,71.12 R28.2
N$39
  Top 0.254: R38.1 22.86,62.87 22.86,48.26 ARDUINO_NANO1.9
N$40
  Top 0.254: ARDUINO_NANO1.7 19.1,47.04 19.1,58.32 20.4,59.61 20.4,64.69 R39.1
N$41
  Top 0.254: ARDUINO_NANO1.8 21.74,46.84 22.33,46.84 23.46,45.71 24.59,45.71 25.6,46.72 25.6,56.54 28,58.93 28,63.56 R37.1
N$42
  Bottom 0.254: LED1.A 6.5,66.09 6.57,66.09 9.82,69.34 17.91,69.34 22.86,74.3 22.86,74.77 24.45,76.36 25.24,76.36 26.67,74.93 R37.2
N$43
  Bottom 0.254: LED2.A 11.58,66.09 11.96,66.09 14.17,68.3 18.87,68.3 24.77,74.19 R38.2
N$44
  Top 0.254: LED3.A 16.66,66.09 16.66,68.48 20.32,72.14 R39.2
N$45
  Top 0.254: ARDUINO_NANO1.4 12.7,45.72 21.59,45.72 R36.1
N$46
  Top 0.254: C16.2 40.01,64.14 U5.3
  Bottom 0.254: C16.2 39.42,58.42 35.61,54.61 35.61,50.75 ARDUINO_NANO1.15
N$47
  Top 0.254: D1.6 5.08,86.41 5.49,86.41 7.93,88.86 14.73,88.86 16.4,87.19 16.4,86.49 18.73,84.16 18.73,84.14 20.32,84.14 R35.1
N$48
  Bottom 0.254: D1.7 12.06,81.92 25.4,81.92 27.3,83.82 R34.1
N$49
  Top 0.254: R30.1 42.55,84.56 39.92,81.94 18.9,81.94 8.13,71.17 7.72,71.17 D1.4
N$50
  Top 0.254: R29.1 45.72,85.09 41.91,81.28 20.32,81.28 12.7,73.66 D1.2
N$51
  Bottom 0.254: D1.1 15.24,72.71 20,77.47 23.18,77.47 26.35,80.64 R28.1
N$52
  Bottom 0.254: D1.9 15.88,83.19 23.5,83.19 25.4,85.09 25.4,87 26.04,87.63 29.84,87.63 R33.1
N$53
  Top 0.254: D1.10 15.24,86.41 18.26,83.39 34.5,83.39 36.2,85.09 R32.1
N$54
  Top 0.254: R31.1 39.37,85.25 36.79,82.66 16.98,82.66 5.49,71.17 5.08,71.17 D1.5
PWMIN  (via drill 0.5)
  Top 0.254: J10.6 J10.5 | J1.2 19.68,4.45 20.32,3.81 33.15,3.81 33.15,3.79 v33.79,3.16
  Bottom 0.254: J10.6 70.34,13.34 71.89,11.79 71.89,5.86 70.48,4.45 59.87,4.45 58.58,3.16 v33.79,3.16 | RV2.3 10.19,6.99 14.61,6.99 15.88,8.26 19.05,8.26 19.68,7.62 J1.2
RAMPOUT  (via drill 0.5)
  Top 0.254: R36.2 44.64,43.18 46.41,41.41 53.51,41.41 v54.46,42.37 | U2.8 U2.9 53.44,14.71 53.44,11.43 54.71,10.16 v54.71,7.7 | J10.9 J10.10
  Bottom 0.254: U2.8 62.38,20.98 62.38,22.54 68.74,28.89 68.74,36.99 63.36,42.37 v54.46,42.37 | v54.71,7.7 56.69,5.71 J10.9 | J1.7 32.38,2.54 33.06,1.86 67.9,1.86 J10.10
REF
  Top 0.254: R21.2 86.36,59.59 87.38,60.6 87.38,71.12 86.11,72.39 J13.5 86.36,73.66 86.36,77.15 RV3.2 82.55,79.38 81.92,78.74 81.92,74.3 78.11,70.48 78.11,68.1 TP1.TP
SQUAREOUT
  Top 0.254: J10.8 J10.7 68.58,11.43 56.52,11.43 55.88,10.79 55.88,7.62 56.52,6.99 56.52,5.71 55.24,4.45 50.16,4.45 44.62,9.99 44.62,16.29 43.48,17.42 39.03,17.42 38.76,17.14 36.83,17.14 35.56,18.41 U1.2 U1.1 29.21,10.62 27.48,8.89 23.5,8.89 22.23,7.62 J1.3
SYNCIN1
  Bottom 0.254: J1.6 29.84,7.62 34.92,12.7 43.59,12.7 48.81,17.93 61.58,17.93 64.77,21.11 64.77,23.97 69.53,28.73 69.53,44.77 64.77,49.53 C4.1
TRIANGLEOUT
  Top 0.254: U2.14 U2.13
  Bottom 0.254: U2.14 44.45,18.41 40.64,18.41 36.2,13.97 33.66,13.97 27.3,7.62 J1.5
TUNERPOWER
  Top 0.254: R40.1 41.17,41.76 36.58,41.76 34.29,39.47 P1.10 P1.9
  Bottom 0.254: R40.1 41.27,53.02 39.69,54.61 R27.2
VP
  Top 0.254: IC1.4 57.1,44.4 57.1,43.13 53.98,40.01 46.35,40.01 45.09,38.73 45.09,30.16 43.81,28.89 38.42,28.89 R9.1 38.1,26.04 33.02,20.95 U1.3
VPWM
  Top 0.254: IC1.5 54.56,44.43 52.74,42.62 46.13,42.62 43.92,44.83 33.93,44.83 32.92,43.81 32.92,35.6 31.7,34.38 31.7,22.23 25.41,22.23 U1.7 19.68,20.32 R15.2 18.26,20.16 R14.2
VSO
  Bottom 0.254: IC1.8 47.14,44.4 47.55,44.4 51.45,40.5 63.87,40.5 67.79,36.58 67.79,28.98 65.12,26.32 62.51,26.32 U2.10
VTO
  Bottom 0.254: U2.12 51.57,20.95 49.58,22.94 49.58,36.68 IC1.10

### Text on the board
tPlace: Based on design from: | 4v | -12v | +12v | LINKCV | PWMIN | VCO 1222 Eurorack / Yoram Scheer | SQOUT | V1.0 / Jan-2020 | GND / PWIN / SOUT / FMIN / TOUT / SYIN / ROUT / CVIN / 1OIN / GND | RAOUT
bPlace: Ref Trim >>>> | Track | HF Track | Center / Note | VCO - Jan 2020 | PW | Fine Tune | PWM | CV Level
Reference: GND